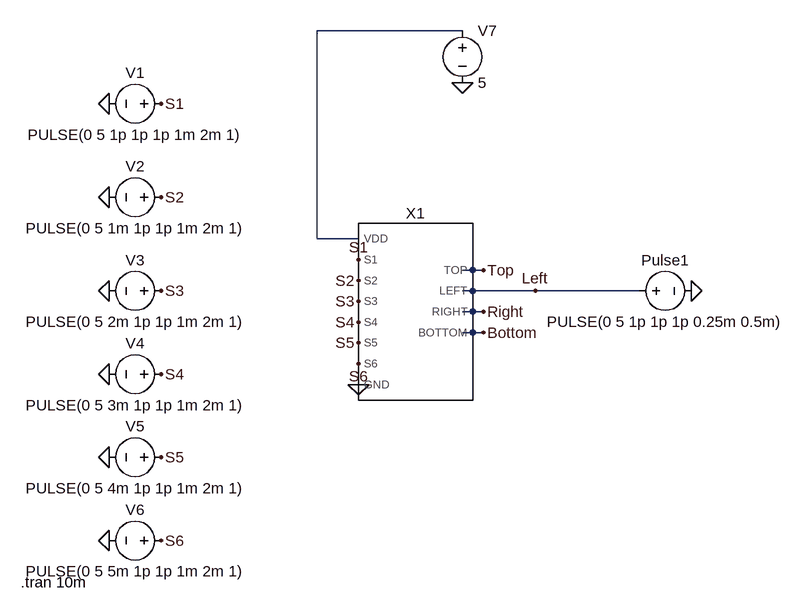
[diagram p0: schematic switch_with_passgate test.asc]
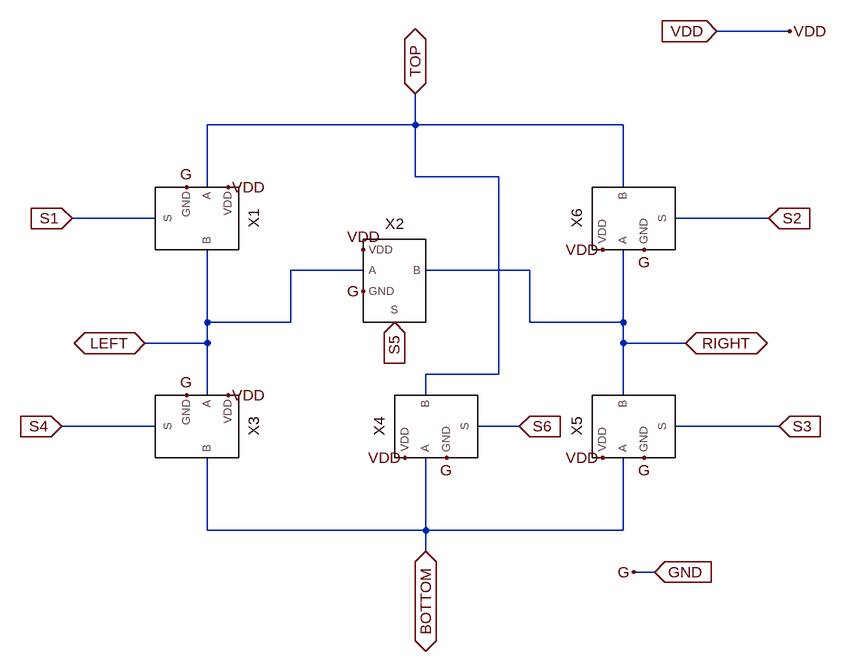
[diagram p1: sub-circuit switch_with_passgate.asc]
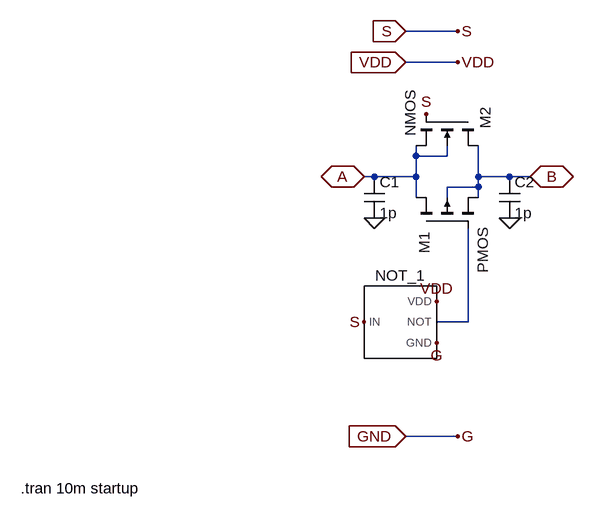
[diagram p2: sub-circuit passgate.asc]
switch_with_passgate test.asc, the LTspice schematic file:
Version 4
SHEET 1 880 680
WIRE 304 -352 80 -352
WIRE 80 -32 80 -352
WIRE 144 -32 80 -32
WIRE 320 16 304 16
WIRE 336 16 320 16
WIRE 320 48 304 48
WIRE 416 48 320 48
WIRE 576 48 416 48
WIRE 320 80 304 80
WIRE 336 80 320 80
WIRE 320 112 304 112
WIRE 336 112 320 112
FLAG 144 192 0
FLAG 144 0 S1
FLAG -160 -240 S1
FLAG -160 -96 S2
FLAG -160 48 S3
FLAG -160 176 S4
FLAG -160 304 S5
FLAG -160 432 S6
FLAG 144 32 S2
FLAG 144 64 S3
FLAG 144 96 S4
FLAG 144 128 S5
FLAG 144 160 S6
FLAG 336 16 Top
FLAG 336 80 Right
FLAG 336 112 Bottom
FLAG 416 48 Left
FLAG -240 -240 0
FLAG -240 -96 0
FLAG -240 48 0
FLAG -240 176 0
FLAG -240 304 0
FLAG -240 432 0
FLAG 656 48 0
FLAG 304 -272 0
SYMBOL voltage -144 -240 R90
WINDOW 0 -32 56 VBottom 2
WINDOW 3 32 56 VTop 2
WINDOW 123 0 0 Left 0
WINDOW 39 0 0 Left 0
SYMATTR InstName V1
SYMATTR Value PULSE(0 5 1p 1p 1p 1m 2m 1)
SYMBOL voltage 560 48 M90
WINDOW 0 -32 56 VBottom 2
WINDOW 3 32 56 VTop 2
WINDOW 123 0 0 Left 0
WINDOW 39 0 0 Left 0
SYMATTR InstName Pulse1
SYMATTR Value PULSE(0 5 1p 1p 1p 0.25m 0.5m)
SYMBOL voltage -144 -96 R90
WINDOW 0 -32 56 VBottom 2
WINDOW 3 32 56 VTop 2
WINDOW 123 0 0 Left 0
WINDOW 39 0 0 Left 0
SYMATTR InstName V2
SYMATTR Value PULSE(0 5 1m 1p 1p 1m 2m 1)
SYMBOL voltage -144 48 R90
WINDOW 0 -32 56 VBottom 2
WINDOW 3 32 56 VTop 2
WINDOW 123 0 0 Left 0
WINDOW 39 0 0 Left 0
SYMATTR InstName V3
SYMATTR Value PULSE(0 5 2m 1p 1p 1m 2m 1)
SYMBOL voltage -144 176 R90
WINDOW 0 -32 56 VBottom 2
WINDOW 3 32 56 VTop 2
WINDOW 123 0 0 Left 0
WINDOW 39 0 0 Left 0
SYMATTR InstName V4
SYMATTR Value PULSE(0 5 3m 1p 1p 1m 2m 1)
SYMBOL voltage -144 304 R90
WINDOW 0 -32 56 VBottom 2
WINDOW 3 32 56 VTop 2
WINDOW 123 0 0 Left 0
WINDOW 39 0 0 Left 0
SYMATTR InstName V5
SYMATTR Value PULSE(0 5 4m 1p 1p 1m 2m 1)
SYMBOL voltage -144 432 R90
WINDOW 0 -32 56 VBottom 2
WINDOW 3 32 56 VTop 2
WINDOW 123 0 0 Left 0
WINDOW 39 0 0 Left 0
SYMATTR InstName V6
SYMATTR Value PULSE(0 5 5m 1p 1p 1m 2m 1)
SYMBOL switch_with_passgate 224 80 R0
SYMATTR InstName X1
SYMBOL voltage 304 -368 R0
SYMATTR InstName V7
SYMATTR Value 5
TEXT -376 496 Left 2 !.tran 10m

switch_with_passgate.asc, the sub-circuit schematic file:
Version 4
SHEET 1 984 680
WIRE 896 -288 784 -288
WIRE 320 -144 320 -192
WIRE 320 -144 0 -144
WIRE 640 -144 320 -144
WIRE 320 -64 320 -144
WIRE 448 -64 320 -64
WIRE 0 -48 0 -144
WIRE 640 -48 640 -144
WIRE -80 0 -208 0
WIRE 864 0 720 0
WIRE 240 80 128 80
WIRE 496 80 336 80
WIRE 0 160 0 48
WIRE 128 160 128 80
WIRE 128 160 0 160
WIRE 496 160 496 80
WIRE 640 160 640 48
WIRE 640 160 496 160
WIRE 0 192 0 160
WIRE 0 192 -96 192
WIRE 640 192 640 160
WIRE 736 192 640 192
WIRE 448 240 448 -64
WIRE 448 240 336 240
WIRE 0 272 0 192
WIRE 336 272 336 240
WIRE 640 272 640 192
WIRE -80 320 -224 320
WIRE 480 320 416 320
WIRE 880 320 720 320
WIRE 0 480 0 368
WIRE 336 480 336 368
WIRE 336 480 0 480
WIRE 640 480 640 368
WIRE 640 480 336 480
WIRE 336 512 336 480
WIRE 688 544 656 544
FLAG -208 0 S1
IOPIN -208 0 In
FLAG -224 320 S4
IOPIN -224 320 In
FLAG 864 0 S2
IOPIN 864 0 In
FLAG 880 320 S3
IOPIN 880 320 In
FLAG 480 320 S6
IOPIN 480 320 In
FLAG 288 160 S5
IOPIN 288 160 In
FLAG 688 544 GND
IOPIN 688 544 In
FLAG 736 192 RIGHT
IOPIN 736 192 BiDir
FLAG -96 192 LEFT
IOPIN -96 192 BiDir
FLAG 320 -192 TOP
IOPIN 320 -192 BiDir
FLAG 336 512 BOTTOM
IOPIN 336 512 BiDir
FLAG 656 544 G
FLAG 784 -288 VDD
IOPIN 784 -288 In
FLAG 896 -288 VDD
FLAG -32 -48 G
FLAG 240 112 G
FLAG 672 48 G
FLAG 672 368 G
FLAG 368 368 G
FLAG -32 272 G
FLAG 32 -48 VDD
FLAG 240 48 VDD
FLAG 608 48 VDD
FLAG 608 368 VDD
FLAG 304 368 VDD
FLAG 32 272 VDD
SYMBOL passgate 0 0 R90
SYMATTR InstName X1
SYMBOL passgate 288 80 R0
SYMATTR InstName X2
SYMBOL passgate 0 320 R90
SYMATTR InstName X3
SYMBOL passgate 336 320 R270
SYMATTR InstName X4
SYMBOL passgate 640 320 R270
SYMATTR InstName X5
SYMBOL passgate 640 0 R270
SYMATTR InstName X6

passgate.asc, the sub-circuit schematic file:
Version 4
SHEET 1 880 688
WIRE 192 -32 112 -32
WIRE 192 16 112 16
WIRE 128 160 128 144
WIRE 176 160 176 144
WIRE 176 160 128 160
WIRE 64 192 48 192
WIRE 128 192 128 160
WIRE 128 192 64 192
WIRE 224 192 224 144
WIRE 272 192 224 192
WIRE 304 192 272 192
WIRE 224 208 224 192
WIRE 224 208 176 208
WIRE 128 224 128 192
WIRE 176 224 176 208
WIRE 224 224 224 208
WIRE 208 416 208 272
WIRE 208 416 160 416
WIRE 192 592 112 592
FLAG 112 -32 S
IOPIN 112 -32 In
FLAG 192 -32 S
FLAG 144 96 S
FLAG 48 416 S
FLAG 112 16 VDD
IOPIN 112 16 In
FLAG 192 16 VDD
FLAG 160 384 VDD
FLAG 112 592 GND
IOPIN 112 592 In
FLAG 192 592 G
FLAG 160 448 G
FLAG 48 192 A
IOPIN 48 192 BiDir
FLAG 304 192 B
IOPIN 304 192 BiDir
FLAG 64 256 0
FLAG 272 256 0
SYMBOL pmos4 128 272 R270
WINDOW 0 -39 13 Left 2
WINDOW 3 -69 103 Left 2
SYMATTR InstName M1
SYMBOL nmos4 224 96 R90
WINDOW 0 -11 -11 Left 2
WINDOW 3 -38 105 Left 2
SYMATTR InstName M2
SYMBOL not 96 416 R0
SYMATTR InstName NOT_1
SYMBOL cap 48 192 R0
SYMATTR InstName C1
SYMATTR Value 1p
SYMBOL cap 256 192 R0
SYMATTR InstName C2
SYMATTR Value 1p
TEXT -480 672 Left 2 !.tran 10m startup

The netlist it stands for:
* switch_with_passgate test.asc
V1 S1 0 PULSE(0 5 1p 1p 1p 1m 2m 1)
V§Pulse1 Left 0 PULSE(0 5 1p 1p 1p 0.25m 0.5m)
V2 S2 0 PULSE(0 5 1m 1p 1p 1m 2m 1)
V3 S3 0 PULSE(0 5 2m 1p 1p 1m 2m 1)
V4 S4 0 PULSE(0 5 3m 1p 1p 1m 2m 1)
V5 S5 0 PULSE(0 5 4m 1p 1p 1m 2m 1)
V6 S6 0 PULSE(0 5 5m 1p 1p 1m 2m 1)
XX1 0 S1 S2 S3 S4 S5 S6 N001 Bottom Left Right Top switch_with_passgate
V7 N001 0 5

* block symbol definitions
.subckt switch_with_passgate GND S1 S2 S3 S4 S5 S6 VDD BOTTOM LEFT RIGHT TOP
XX1 GND S1 VDD TOP LEFT passgate
XX2 GND S5 VDD LEFT RIGHT passgate
XX3 GND S4 VDD LEFT BOTTOM passgate
XX4 GND S6 VDD BOTTOM TOP passgate
XX5 GND S3 VDD BOTTOM RIGHT passgate
XX6 GND S2 VDD RIGHT TOP passgate
.ends switch_with_passgate

.subckt passgate GND S VDD A B
M1 A N001 B B PMOS
M2 B S A A NMOS
XNOT_1 S GND N001 VDD not  ; pins IN GND NOT VDD
C1 A 0 1p
C2 B 0 1p
.tran 10m startup
.ends passgate

.model NMOS NMOS
.model PMOS PMOS
.lib standard.mos
.tran 10m
.backanno
.end